# EAGLE design RFID_H2_v6 (EAGLE 9.6.2)
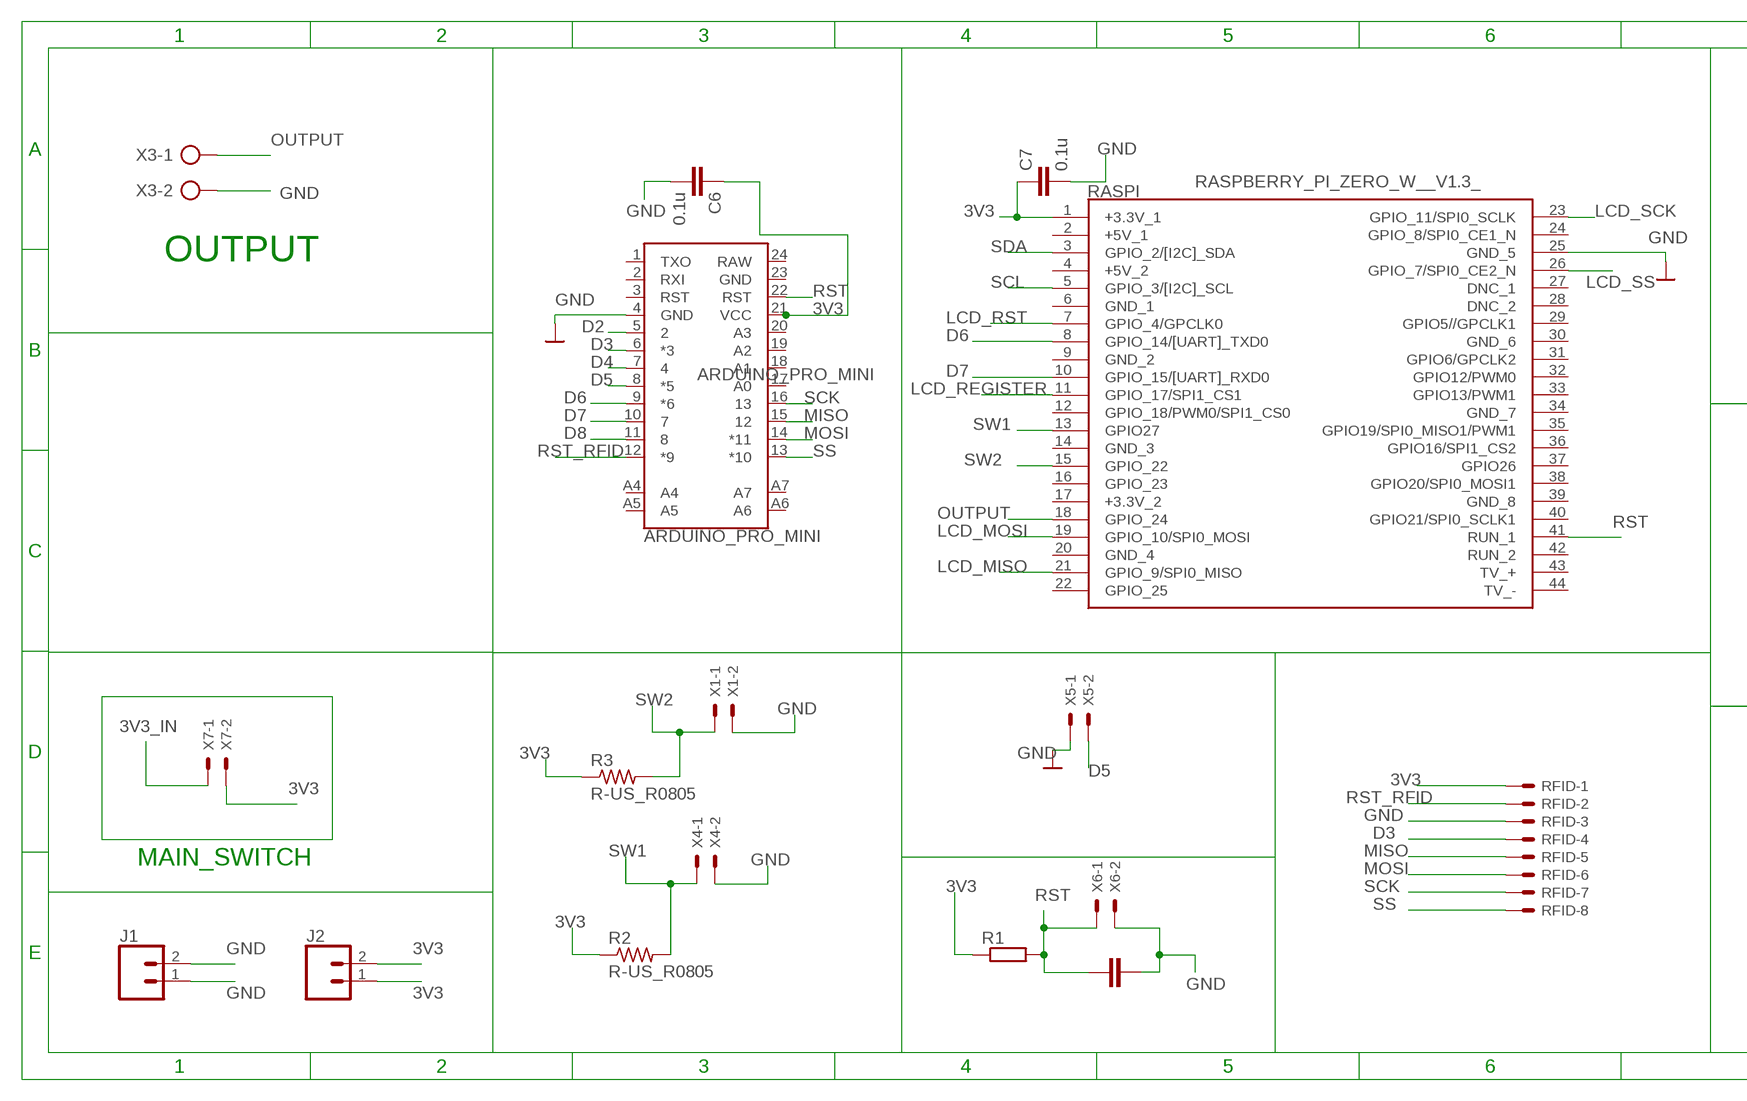
[diagram p0: schematic, sheet 1, part 1 of 2]
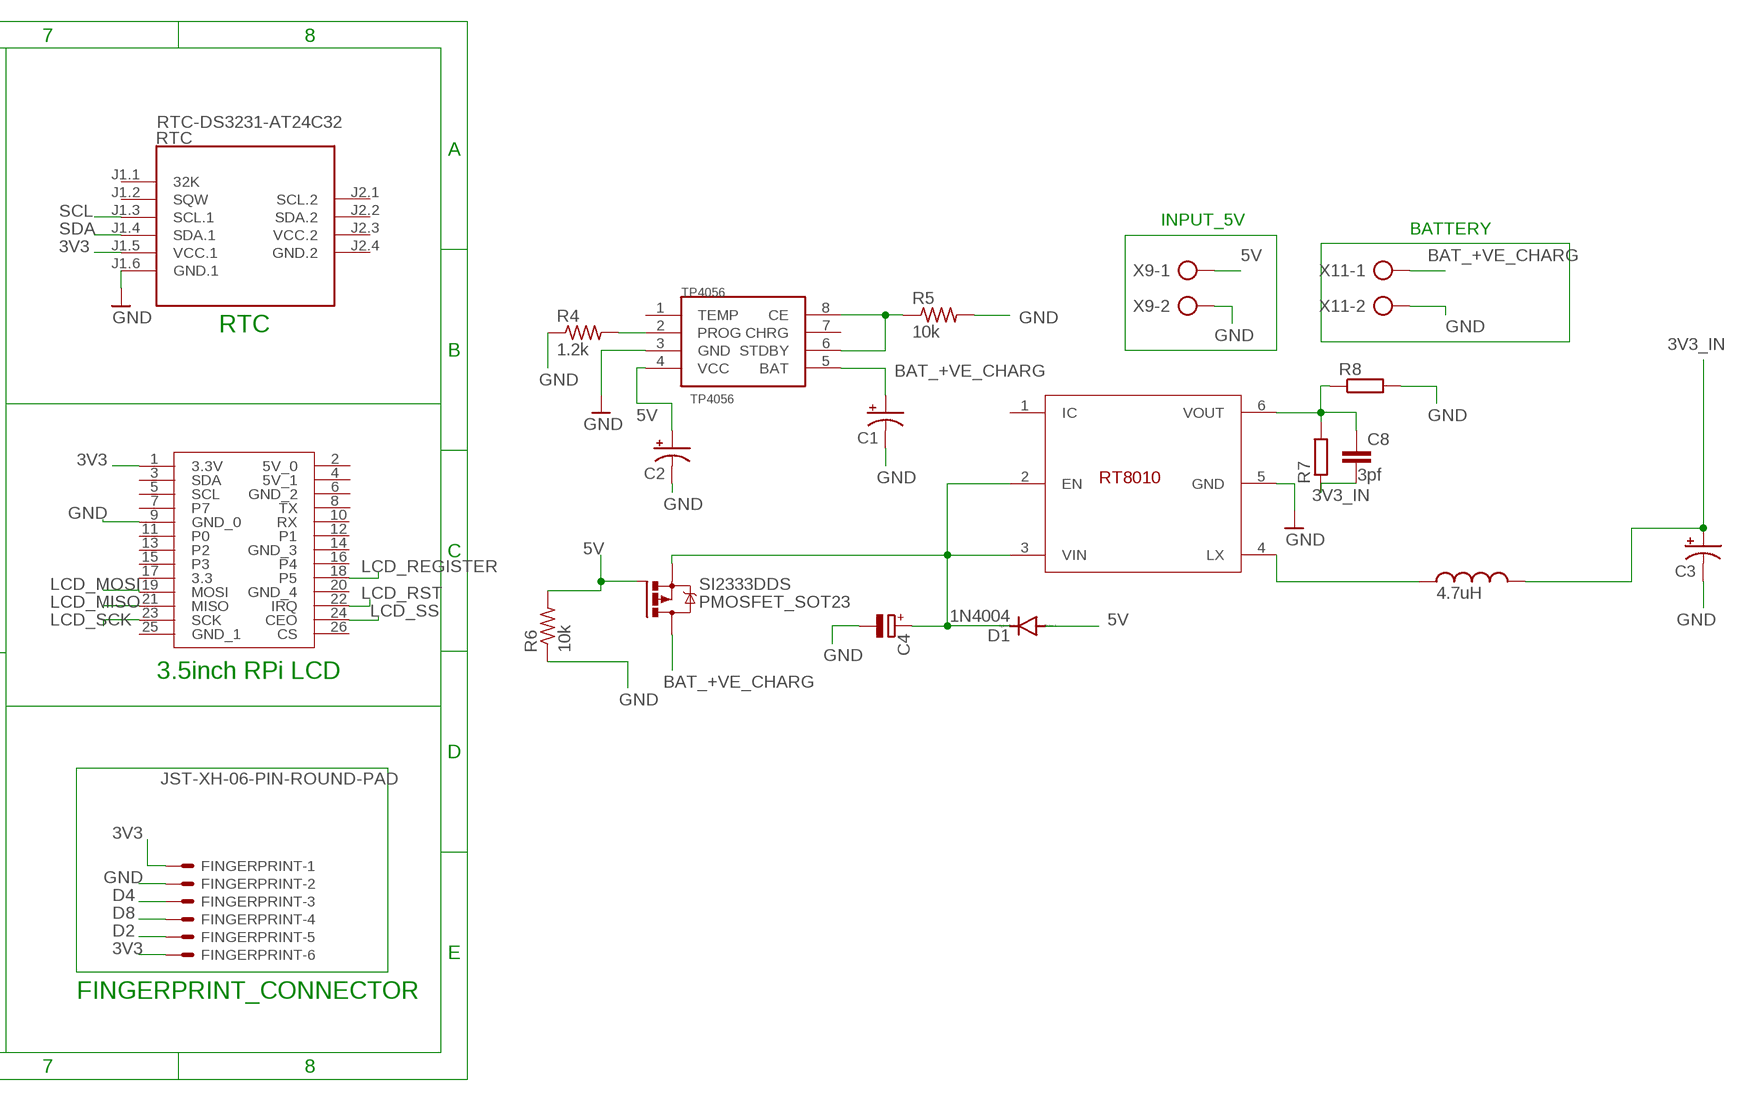
[diagram p1: schematic, sheet 1, part 2 of 2]

## Parts
ARDUINO_PRO_MINI  ARDUINO_PRO_MINI  [ARDUINO_PRO_MINI]
C1  10uf  CAP_POL_10V  [C/6032-28R]
C2  10uf  CAP_POL_10V  [C/6032-28R]
C3  10uf  CAP_POL_10V  [C/6032-28R]
C4  4.7uf  CPOL-EUE2.5-6  [E2,5-6]
C5  10n  C-EUC0805K  [C0805K]
C6  0.1u  C-EUC0805  [C0805]
C7  0.1u  C-EUC0805  [C0805]
C8  3pf  C-EU025-025X050  [C025-025X050]
D1  1N4004  [DO41-10]
FINGERPRINT  JST-XH-06-PIN-ROUND-PAD  [JST-XH-06-PACKAGE-ROUND-PAD]
J1  CONN_02  [1X02]
J2  CONN_02  [1X02]
L2  4.7uH  WE-TI_8095_744772047  [WE-TI_TIHV_8095]
R1  R-EU_0204/5  [0204/5]
R2  R-US_R0805  [R0805]
R3  R-US_R0805  [R0805]
R4  1.2k  R-US_R0805  [R0805]
R5  10k  R-US_R0805  [R0805]
R6  10k  R-US_R0805  [R0805]
R7  1.2M  R-EU_0204/7  [0204/7]
R8  270K  R-EU_0204/7  [0204/7]
RASPI  RASPBERRY_PI_ZERO_W__V1.3_  [RASPBERRYPIZEROWV13]
RFID  JST-XH-08-PIN-ROUND-PAD  [JST-XH-08-PACKAGE-ROUND-PAD]
RT8010  RT8010_BUCK_CONVERTER  [RT8010]
RTC  RTC-DS3231-AT24C32  [RTC-DS3231-AT24C32]
SI2333DDS  PMOSFET_SOT23  [SOT23]
TP4056  TP4056  [SOP-8]
U$7  3.5_INCH_TOUCHSCREEN  [FE13-2]
X1  JST-XH-02-PIN-LONG-PAD  [JST-XH-02-PACKAGE-LONG-PAD]
X3  AK500/2-H  [AK500/2-H]
X4  JST-XH-02-PIN-LONG-PAD  [JST-XH-02-PACKAGE-LONG-PAD]
X5  JST-XH-02-PIN-LONG-PAD  [JST-XH-02-PACKAGE-LONG-PAD]
X6  JST-XH-02-PIN-LONG-PAD  [JST-XH-02-PACKAGE-LONG-PAD]
X7  JST-XH-02-PIN-LONG-PAD  [JST-XH-02-PACKAGE-LONG-PAD]
X9  AK500/2-H  [AK500/2-H]
X11  AK500/2-H  [AK500/2-H]

## Nets
3V3: ARDUINO_PRO_MINI.21(VCC) C6.1 C7.1 FINGERPRINT.1 FINGERPRINT.6 J2.1 J2.2 R1.1 R2.1 R3.1 RASPI.1(+3.3V_1) RFID.1 RTC.J1.5(VCC.1) U$7.1(3.3V) X7.2
3V3_IN: C3.+ C8.2 L2.2 R7.1 X7.1
5V: C2.+ D1.A R6.2 SI2333DDS.1(G) TP4056.4(VCC) X9.1
BAT_+VE_CHARG: C1.+ SI2333DDS.3(D) TP4056.5(BAT) X11.1
D2: ARDUINO_PRO_MINI.5 FINGERPRINT.5
D3: ARDUINO_PRO_MINI.6(*3) RFID.4
D4: ARDUINO_PRO_MINI.7 FINGERPRINT.3
D5: ARDUINO_PRO_MINI.8(*5) X5.2
D6: ARDUINO_PRO_MINI.9(*6) RASPI.8(GPIO_14/[UART]_TXD0)
D7: ARDUINO_PRO_MINI.10 RASPI.10(GPIO_15/[UART]_RXD0)
D8: ARDUINO_PRO_MINI.11 FINGERPRINT.4
GND: ARDUINO_PRO_MINI.4(GND) C1.- C2.- C3.- C4.- C5.1 C6.2 C7.2 FINGERPRINT.2 J1.1 J1.2 R4.1 R5.2 R6.1 R8.2 RASPI.25(GND_5) RFID.3 RT8010.5(GND) RTC.J1.6(GND.1) TP4056.3(GND) U$7.9(GND_0) X1.2 X3.2 X4.2 X5.1 X6.2 X9.2 X11.2
LCD_MISO: RASPI.21(GPIO_9/SPI0_MISO) U$7.21(MISO)
LCD_MOSI: RASPI.19(GPIO_10/SPI0_MOSI) U$7.19(MOSI)
LCD_REGISTER: RASPI.11(GPIO_17/SPI1_CS1) U$7.18(P5)
LCD_RST: RASPI.7(GPIO_4/GPCLK0) U$7.22(IRQ)
LCD_SCK: RASPI.23(GPIO_11/SPI0_SCLK) U$7.23(SCK)
LCD_SS: RASPI.26(GPIO_7/SPI0_CE2_N) U$7.24(CEO)
MISO: ARDUINO_PRO_MINI.15 RFID.5
MOSI: ARDUINO_PRO_MINI.14(*11) RFID.6
N$2: C8.1 R7.2 R8.1 RT8010.6(VOUT)
N$4: R4.2 TP4056.2(PROG)
N$5: R5.1 TP4056.6(STDBY) TP4056.8(CE)
N$6: L2.1 RT8010.4(LX)
N$8: C4.+ D1.C RT8010.2(EN) RT8010.3(VIN) SI2333DDS.2(S)
OUTPUT: RASPI.18(GPIO_24) X3.1
RST: ARDUINO_PRO_MINI.22(RST) C5.2 R1.2 RASPI.41(RUN_1) X6.1
RST_RFID: ARDUINO_PRO_MINI.12(*9) RFID.2
SCK: ARDUINO_PRO_MINI.16 RFID.7
SCL: RASPI.5(GPIO_3/[I2C]_SCL) RTC.J1.3(SCL.1)
SDA: RASPI.3(GPIO_2/[I2C]_SDA) RTC.J1.4(SDA.1)
SS: ARDUINO_PRO_MINI.13(*10) RFID.8
SW1: R2.2 RASPI.13(GPIO27) X4.1
SW2: R3.2 RASPI.15(GPIO_22) X1.1
Unconnected: ARDUINO_PRO_MINI.1(TXO) ARDUINO_PRO_MINI.2(RXI) ARDUINO_PRO_MINI.3(RST) ARDUINO_PRO_MINI.17(A0) ARDUINO_PRO_MINI.18(A1) ARDUINO_PRO_MINI.19(A2) ARDUINO_PRO_MINI.20(A3) ARDUINO_PRO_MINI.A4 ARDUINO_PRO_MINI.A5 ARDUINO_PRO_MINI.A6 ARDUINO_PRO_MINI.A7 RASPI.2(+5V_1) RASPI.4(+5V_2) RASPI.6(GND_1) RASPI.9(GND_2) RASPI.12(GPIO_18/PWM0/SPI1_CS0) RASPI.14(GND_3) RASPI.16(GPIO_23) RASPI.17(+3.3V_2) RASPI.20(GND_4) RASPI.22(GPIO_25) RASPI.24(GPIO_8/SPI0_CE1_N) RASPI.27(DNC_1) RASPI.28(DNC_2) RASPI.29(GPIO5//GPCLK1) RASPI.30(GND_6) RASPI.31(GPIO6/GPCLK2) RASPI.32(GPIO12/PWM0) RASPI.33(GPIO13/PWM1) RASPI.34(GND_7) RASPI.35(GPIO19/SPI0_MISO1/PWM1) RASPI.36(GPIO16/SPI1_CS2) RASPI.37(GPIO26) RASPI.38(GPIO20/SPI0_MOSI1) RASPI.39(GND_8) RASPI.40(GPIO21/SPI0_SCLK1) RASPI.42(RUN_2) RASPI.43(TV_+) RASPI.44(TV_-) RT8010.1(IC) RTC.J1.1(32K) RTC.J1.2(SQW) RTC.J2.1(SCL.2) RTC.J2.2(SDA.2) TP4056.1(TEMP) TP4056.7(CHRG) U$7.2(5V_0) U$7.3(SDA) U$7.4(5V_1) U$7.5(SCL) U$7.6(GND_2) U$7.7 U$7.8(TX) U$7.10(RX) U$7.11(P0) U$7.12(P1) U$7.13(P2) U$7.14(GND_3) U$7.15(P3) U$7.16(P4) U$7.17(3.3) U$7.20(GND_4) U$7.25(GND_1) U$7.26(CS)

## Notes on the sheet
- INPUT_5V
- BATTERY
- OUTPUT
- RTC
- 3.5inch RPi LCD
- MAIN_SWITCH
- FINGERPRINT_CONNECTOR

## Power pins joined to a net without a drawn wire
GND: ARDUINO_PRO_MINI.23(GND)
GND.2: RTC.J2.4(GND.2)
RAW: ARDUINO_PRO_MINI.24(RAW)
VCC.2: RTC.J2.3(VCC.2)

## Library data of the parts
ARDUINO_PRO_MINI = SparkFun-Boards:ARDUINO_PRO_MINI: SparkFun Pro Mini Pro Mini compatible footprint. Dimensions: 0.7 x 1.3" PCB Thickness: 0.8mm SparkFun Products: 3.3V/8MHz <https://www.sparkfun.com/products/11114> 5V/16MHz <https://www.sparkfun.com/products/11113>
C1-C3 = CEDT_JANUARY_2015_v5:CAP_POL
C4 = rcl:CPOL-EU: POLARIZED CAPACITOR, European symbol; SPICEPREFIX: C
C5-C8 = rcl:C-EU: CAPACITOR, European symbol; SPICEPREFIX: C
D1 = diode:1N4004: DIODE general purpose rectifier, 1 A
FINGERPRINT = Rembrandt Electronics - JST XH Connectors v1-0:JST-XH-06-PIN: JST XH Connector 2 Pin Wire to board connector. Pitch: 2,54 mm, (0.100") Number of pins: 6 Created by Rembrandt Electronics www.rembrandtelectronics.com
J1 J2 = SparkFun-Connectors:CONN_02: Multi connection point. Often used as Generic Header-pin footprint for 0.1 inch spaced/style header connections On any of the 0.1 inch spaced packages, you can populate with these: Break Away Headers - Straight <https://www.sparkfun.com/products/116> (PRT-00116) Break Away Male Headers - Right Angle <https://www.sparkfun.com/products/553> (PRT-00553) Female Headers <https://www.sparkfun.com/products/115> (PRT-00115) Break Away Headers - Machine Pin <https://www.sparkfun.com/products/117> (PRT-00117) Break Away Female Headers - Swiss Machine Pin <https://www.sparkfun.com/products/743> (PRT-00743) For SCREWTERMINALS and SPRING TERMINALS visit here: Screw Terimnals on SparkFun.com <https://www.sparkfun.com/search/results?term=Screw+Terminals> (5mm/3.5mm/2.54mm spacing) This device is also useful as a general connection point to wire up your design to another part of your project. Our various solder wires solder well into these plated through hole pads. Hook-Up Wire - Assortment (Stranded, 22 AWG) <https://www.sparkfun.com/products/11375> (PRT-11375) Hook-Up Wire - Assortment (Solid Core, 22 AWG) <https://www.sparkfun.com/products/11367> (PRT-11367) View the entire wire category on our website here <https://www.sparkfun.com/categories/141> Special notes: Molex polarized connector foot print use with: PRT-08233 with associated crimp pins and housings. 2.54_SCREWTERM for use with PRT-10571. 3.5mm Screw Terminal footprints for PRT-08084 5mm Screw Terminal footprints for use with PRT-08432
L2 = Wurth_Elektronik_Passive_rev19e:WE-TI_8095: Radial Leaded Wire Wound Inductor Characteristics Radial through-hole inductor High saturation core material Small size Maximum current up to 8.5 A Custom design on request Applications Signal filtering Switches, switching power supply for small and medium voltage Power supply filter EMI filter <http://katalog.we-online.de/media/images/v2/we-ti_tonneninduktivitaet.jpg> Details see: http://katalog.we-online.de/en/pbs/WE-TI? Updated by Dan Xu 2014-07-11 2014 (C) Wurth Elektronik; WE-NUMBER: 744772047/4,7uH
R1 = resistor:R-EU_: RESISTOR, European symbol
R2 R3 = audio amplifier example:R-US_: RESISTOR, American symbol
R4-R6 = adafruit:R-US_: RESISTOR, American symbol
R7 R8 = rcl:R-EU_: RESISTOR, European symbol; SPICEPREFIX: R
RASPI = Raspberry_Pi_Zero_W__v1.3_:RASPBERRY_PI_ZERO_W__V1.3_: Raspberry Pi Zero W (v1.3) Single-board Computers Source: Datasheet <https://cdn.sparkfun.com/assets/learn_tutorials/6/7/6/PiZero_1.pdf>; DESCRIPTION: Raspberry Pi Zero W (v1.3) Single-board Computers; HEIGHT: mm; MANUFACTURER_NAME: RASPBERRY-PI; MANUFACTURER_PART_NUMBER: Raspberry Pi Zero W (v1.3)
RFID = Rembrandt Electronics - JST XH Connectors v1-0:JST-XH-08-PIN: JST XH Connector 2 Pin Wire to board connector. Pitch: 2,54 mm, (0.100") Number of pins: 8 Created by Rembrandt Electronics www.rembrandtelectronics.com
RT8010 = RT8010_buckConverter:RT8010_BUCK_CONVERTER
RTC = diy-modules:RTC-DS3231-AT24C32: RTC Module with Battery and EEPROM based on DS3231 and AT24C32 chips Tutorial can be found here: https://edwardmallon.wordpress.com/2014/05/21/using-a-cheap-3-ds3231-rtc-at24c32-eeprom-from-ebay/ Click here to find device on ebay.com <http://www.ebay.com/sch/DS3231+AT24C32+module>
SI2333DDS = Transistor:PMOSFET: P-Channel MOSFET - Generic; CATEGORY: Transistor; SUB-CATEGORY: MOSFET; TYPE: P-Channel
TP4056 = TP4056:TP4056
U$7 = 3.5_inch_touchscreen:3.5_INCH_TOUCHSCREEN
X1 X4-X7 = Rembrandt Electronics - JST XH Connectors v1-0:JST-XH-02-PIN: JST XH Connector 2 Pin Wire to board connector. Pitch: 2,54 mm, (0.100") Number of pins: 2 Created by Rembrandt Electronics www.rembrandtelectronics.com
X3 X9 X11 = con-ptr500:AK500/2-H: CONNECTOR Aug. 2004 / PTR Meßtechnik: Die Bezeichnung der Serie AK505 wurde geändert. Es handelt sich hierbei um AK500 in horizontaler Ausführung.; OC_FARNELL: unknown; OC_NEWARK: unknown

## Board
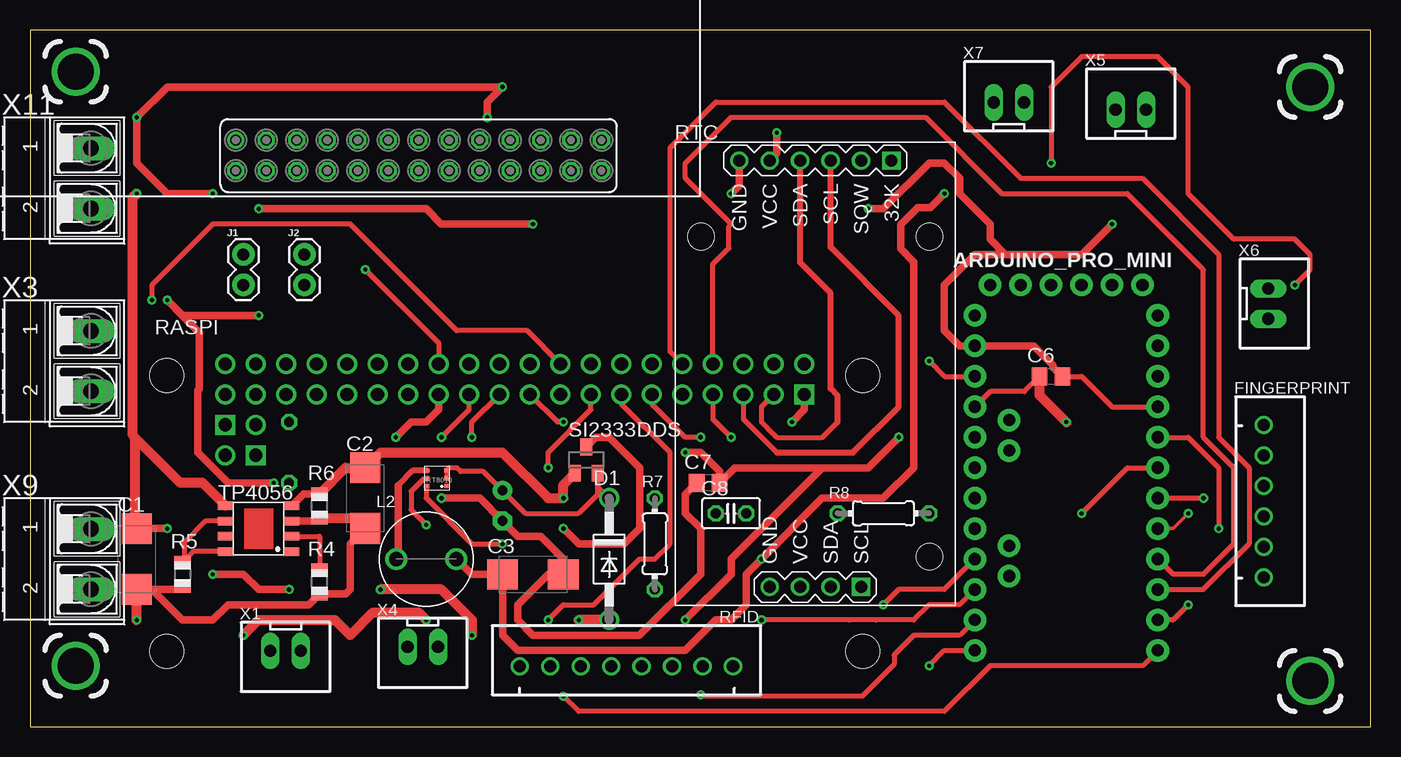
[diagram p2: board, top side]
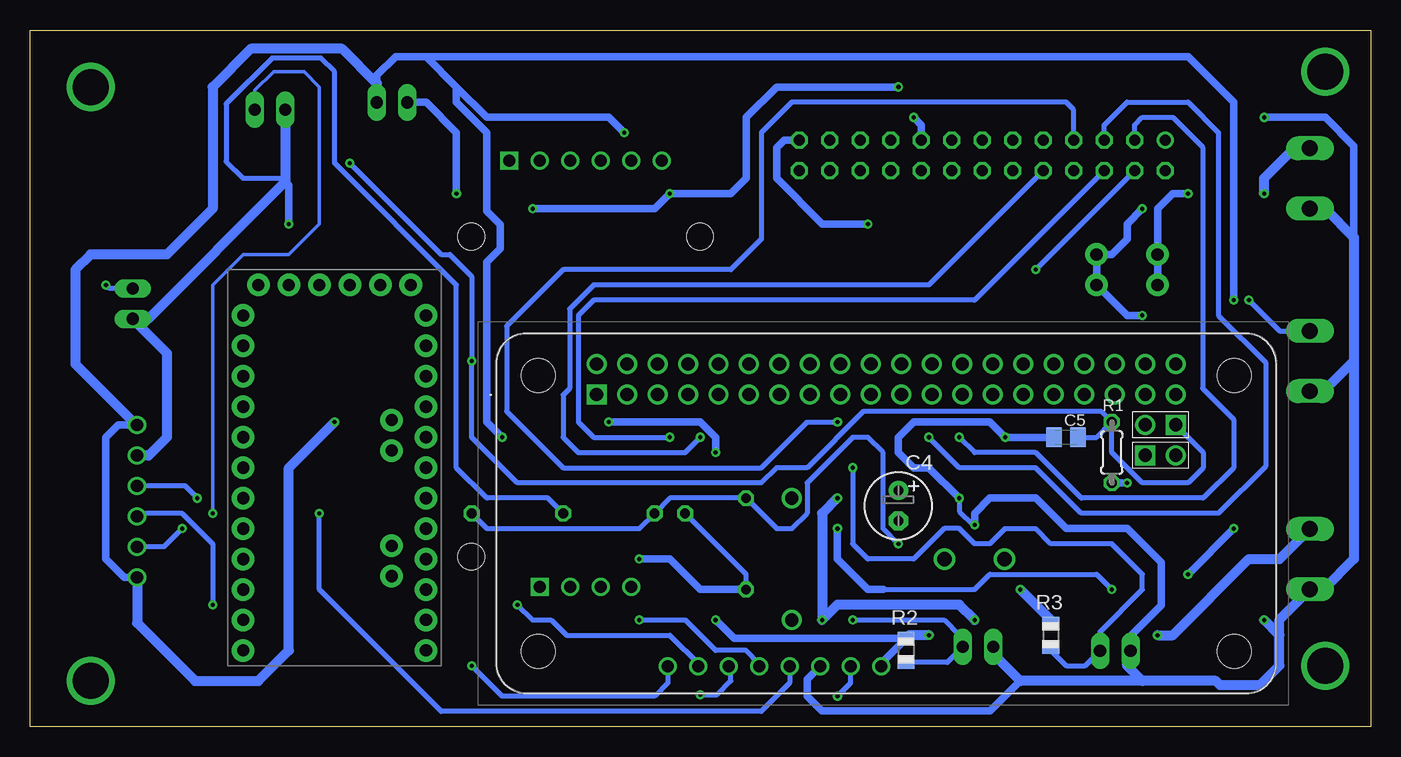
[diagram p3: board, bottom side, seen from below]

Size 111.74 x 58.09 mm. Coordinates in mm from the lower left corner, seen from the top.
Outline: 0,0 111.74,0 111.74,58.09 0,58.09 0,0
Copper layers (1*16): Top 0.035mm / dielectric 1.5mm / Bottom 0.035mm
Design rules "default": minimum track width 6mil, minimum drill 0.35mm, track to track 6mil, track to pad 6mil, pad to pad 6mil, via to via 6mil, smd to smd 6mil, copper to edge 40mil, drill to drill 6mil, minimum pad ring 10mil, minimum via ring 8mil, stop-mask expansion 4mil, vias tented up to drill 0mil, thermal gap 10mil

### Footprints (pad centres in the part's own frame; a part is rotated, then mirrored left to right if it is on the bottom)
ARDUINO_PRO_MINI = drill 1.016 pad 1.88: 1 -7.62,12.7; 2 -7.62,10.16; 3 -7.62,7.62; 4 -7.62,5.08; 5 -7.62,2.54; 6 -7.62,0; 7 -7.62,-2.54; 8 -7.62,-5.08; 9 -7.62,-7.62; 10 -7.62,-10.16; 11 -7.62,-12.7; 12 -7.62,-15.24; 13 7.62,-15.24; 14 7.62,-12.7; 15 7.62,-10.16; 16 7.62,-7.62; 17 7.62,-5.08; 18 7.62,-2.54; 19 7.62,0; 20 7.62,2.54; 21 7.62,5.08; 22 7.62,7.62; 23 7.62,10.16; 24 7.62,12.7; A4 4.763,1.429; A5 4.763,3.969; A6 4.763,-9.049; A7 4.763,-6.509; BLK -6.35,15.24; GND -3.81,15.24; GRN 6.35,15.24; RXI 1.27,15.24; TXO 3.81,15.24; VCC -1.27,15.24
C/6032-28R = smd 2.55 x 2.5: + 2.525,0; - -2.525,0
E2,5-6 = drill 0.813 pad 1.6: + -1.27,0 | drill 0.813 pad 1.6 octagon: - 1.27,0
C0805K = smd 1.3 x 1.6: 1 -1,0; 2 1,0
C0805 = smd 1.3 x 1.5: 1 -0.95,0; 2 0.95,0
C025-025X050 = drill 0.813 octagon: 1 -1.27,0; 2 1.27,0
DO41-10 = drill 1.118: A 5.08,0; C -5.08,0
JST-XH-06-PACKAGE-ROUND-PAD = drill 1.016: 1 -6.35,0; 2 -3.81,0; 3 -1.27,0; 4 1.27,0; 5 3.81,0; 6 6.35,0
1X02 = drill 1.016 pad 1.88: 1 0,0; 2 2.54,0
WE-TI_TIHV_8095 = drill 1.2: 1 -2.5,0; 2 2.5,0
0204/5 = drill 0.813 octagon: 1 -2.54,0; 2 2.54,0
R0805 = smd 1.1 x 1.4: 1 -1,0; 2 1,0
0204/7 = drill 0.813 octagon: 1 -3.81,0; 2 3.81,0
RASPBERRYPIZEROWV13 = drill 1.11 pad 1.665 square: 1 -23.885,9.92; 41 24.375,7.38; 43 21.835,4.84 | drill 1.11 pad 1.665: 2 -23.885,12.46; 3 -21.345,9.92; 4 -21.345,12.46; 5 -18.805,9.92; 6 -18.805,12.46; 7 -16.265,9.92; 8 -16.265,12.46; 9 -13.725,9.92; 10 -13.725,12.46; 11 -11.185,9.92; 12 -11.185,12.46; 13 -8.645,9.92; 14 -8.645,12.46; 15 -6.105,9.92; 16 -6.105,12.46; 17 -3.565,9.92; 18 -3.565,12.46; 19 -1.025,9.92; 20 -1.025,12.46; 21 1.515,9.92; 22 1.515,12.46; 23 4.055,9.92; 24 4.055,12.46; 25 6.595,9.92; 26 6.595,12.46; 27 9.135,9.92; 28 9.135,12.46; 29 11.675,9.92; 30 11.675,12.46; 31 14.215,9.92; 32 14.215,12.46; 33 16.755,9.92; 34 16.755,12.46; 35 19.295,9.92; 36 19.295,12.46; 37 21.835,9.92; 38 21.835,12.46; 39 24.375,9.92; 40 24.375,12.46; 42 21.835,7.38; 44 24.375,4.84 | hole 2.8: -28.755,11.5; -28.755,-11.5; 29.245,-11.5; 29.245,11.5
JST-XH-08-PACKAGE-ROUND-PAD = drill 1.016: 1 -8.89,0; 2 -6.35,0; 3 -3.81,0; 4 -1.27,0; 5 1.27,0; 6 3.81,0; 7 6.35,0; 8 8.89,0
RT8010 = smd 0.35 x 0.4: 1 0.375,0.2; 2 1.025,0.2; 3 1.675,0.2; 4 1.675,1.85; 5 1.025,1.85; 6 0.375,1.85
RTC-DS3231-AT24C32 = drill 1 square: J1.1 -17.78,6.35; J2.1 17.78,3.81 | drill 1: J1.2 -17.78,3.81; J1.3 -17.78,1.27; J1.4 -17.78,-1.27; J1.5 -17.78,-3.81; J1.6 -17.78,-6.35; J2.2 17.78,1.27; J2.3 17.78,-1.27; J2.4 17.78,-3.81 | hole 2.2: -11.43,-9.525; -11.43,9.525; 15.24,9.525
SOT23 = smd 1 x 1.4: 1 -0.95,-1.1; 2 0.95,-1.1; 3 0,1.1
SOP-8 = smd 1.3 x 0.7: 1 -2.75,1.905; 2 -2.75,0.635; 3 -2.75,-0.635; 4 -2.75,-1.905; 5 2.75,-1.905; 6 2.75,-0.635; 7 2.75,0.635; 8 2.75,1.905
FE13-2 = drill 0.914 octagon: 1 15.24,1.27; 2 15.24,-1.27; 3 12.7,1.27; 4 12.7,-1.27; 5 10.16,1.27; 6 10.16,-1.27; 7 7.62,1.27; 8 7.62,-1.27; 9 5.08,1.27; 10 5.08,-1.27; 11 2.54,1.27; 12 2.54,-1.27; 13 0,1.27; 14 0,-1.27; 15 -2.54,1.27; 16 -2.54,-1.27; 17 -5.08,1.27; 18 -5.08,-1.27; 19 -7.62,1.27; 20 -7.62,-1.27; 21 -10.16,1.27; 22 -10.16,-1.27; 23 -12.7,1.27; 24 -12.7,-1.27; 26 -15.24,-1.27 | drill 0.914: 25 -15.24,1.27
JST-XH-02-PACKAGE-LONG-PAD = drill 1.016 long: 1 -1.27,0; 2 1.27,0
AK500/2-H = drill 1.321 long: 1 -2.515,0; 2 2.515,0

### Placement (x,y rotation side)
ARDUINO_PRO_MINI  86.36,21.59 0 bottom
C1  8.89,13.97 90 top
C2  27.94,19.05 90 top
C3  41.91,12.7 180 top
C4  39.37,18.41 270 bottom
C5  25.4,24.13 0 bottom
C6  85.09,29.21 0 top
C7  56.52,20.32 180 top
C8  58.42,17.78 180 top
D1  48.26,13.97 270 top
FINGERPRINT  102.82,18.8 270 top
J1  17.78,36.83 90 top
J2  22.86,36.83 90 top
L2  33.02,13.97 0 top
R1  21.59,22.86 90 bottom
R2  38.73,6.35 270 bottom
R3  26.67,7.62 270 bottom
R4  24.13,12.06 90 top
R5  12.7,12.7 270 top
R6  24.13,18.41 90 top
R7  52.07,15.24 90 top
R8  71.12,17.78 180 top
RASPI  40.64,17.78 0 bottom
RFID  49.7,5.03 0 top
RT8010  34.92,19.68 90 top
RTC  65.44,29.43 270 top
SI2333DDS  46.35,22.22 0 top
TP4056  19.05,16.51 180 top
U$7  32.38,47.62 0 top
X1  21.3,6.32 180 top
X3  5.08,30.48 270 top
X4  32.73,6.65 180 top
X5  91.73,51.44 0 top
X6  103.18,35.27 270 top
X7  81.57,52.05 0 top
X9  5.08,13.97 270 top
X11  5.08,45.72 270 top

### Tracks (layer width: path | path; a pad name or v marks a point on that pad's centre or on a via)
3V3  (via drill 0.35)
  Top 0.406: 83.82,29.21 C6.1 82.87,27.94 80.01,27.94 ARDUINO_PRO_MINI.21
  Top 0.61: v19.05,34.29 12.7,34.29 v11.43,35.56 14.12,32.87 14.12,28.15 13.97,28.01 13.97,22.86 16.51,20.32 v20.32,20.32 | v54.61,22.86 55.88,22.86 57.47,21.27 C7.1 58.73,21.59 66.04,21.59 | v62.23,49.53 62.23,47.81 RTC.J1.5 | v41.91,41.91 34.29,41.91 33.02,43.18 v19.05,43.18 | v72.39,24.13 69.85,21.59 66.04,21.59 | v54.61,8.89 58.42,12.7 58.42,13.97 66.04,21.59 | v63.5,25.4 64.53,26.43 RASPI.1
  Top 0.813: v86.36,25.4 84.14,27.62 C6.1 | v36.83,7.62 36.83,8.89 34.29,11.43 v29.21,11.43
  Bottom 0.406: FINGERPRINT.1 102.87,25.15
  Bottom 0.61: X7.2 82.84,54.32 81.28,55.88 78.74,55.88 | 78.74,55.88 15.24,55.88 11.43,52.07 v11.43,35.56 | v19.05,34.29 20.32,34.29 J2.1 J2.2 21.59,39.37 20.32,40.64 20.32,41.91 v19.05,43.18 | v20.32,20.32 R1.1 | v63.5,25.4 55.88,25.4 54.61,24.13 v54.61,22.86 | 78.74,55.88 76.2,53.34 | 76.2,53.34 73.66,50.8 63.5,50.8 v62.23,49.53 | 76.2,53.34 76.2,52.07 73.66,49.53 73.66,42.98 72.54,41.86 72.54,39.86 73.66,38.74 73.66,25.4 v72.39,24.13 | RFID.1 40.81,5.28 38.92,7.17 R2.1 53.07,7.35 v54.61,8.89 | U$7.1 48.9,48.9 49.53,48.26 49.53,45.72 45.72,41.91 v41.91,41.91 | FINGERPRINT.1 104.39,25.15 105.41,24.13 105.41,13.97 103.89,12.45 FINGERPRINT.6
  Bottom 0.813: X7.2 82.84,53.63 85.72,56.52 93.34,56.52 96.52,53.34 96.52,43.18 100.33,39.37 106.68,39.37 107.95,38.1 107.95,30.23 102.87,25.15 | FINGERPRINT.6 102.82,8.64 97.99,3.81 92.71,3.81 90.17,6.35 90.17,21.59 v86.36,25.4 | v36.83,7.62 38.47,7.62 38.92,7.17 | R3.1 26.67,8.89 v29.21,11.43
3V3_IN  (via drill 0.35)
  Top 0.61: v76.2,44.45 75.03,43.28 73.96,43.28 72.54,41.86 72.54,39.86 73.66,38.74 73.66,21.59 71.12,19.05 66.04,19.05 v60.96,13.97 59.69,12.7 59.69,10.16 58.42,8.89 57.15,8.89 54.61,6.35 40.64,6.35 39.38,7.61 C3.+ 36.83,12.7 35.56,13.97 L2.2
  Bottom 0.406: R7.1 52.07,12.7 C8.2
  Bottom 0.61: v76.2,44.45 76.2,49.53 78.74,52.07 80.28,52.07 X7.1 | R7.1 55.88,11.43 58.42,13.97 v60.96,13.97
5V  (via drill 0.35)
  Top 0.61: TP4056.4 22.8,19.41 R6.2
  Top 0.813: R6.2 26.29,21.57 C2.+ 29.23,22.86 39.37,22.86 43.18,19.05 v44.45,19.05 44.45,20.17 SI2333DDS.1 | D1.A v45.72,8.89 | v17.78,7.62 19.05,8.89 25.4,8.89 26.67,7.62 28.57,9.53 32.38,9.53 v33.02,8.89
  Bottom 0.813: 5.11,16.48 X9.1 7.59,13.97 10.16,13.97 16.51,7.62 v17.78,7.62 | v44.45,19.05 45.72,17.78 v45.72,8.89 44.45,10.16 34.29,10.16 v33.02,8.89
BAT_+VE_CHARG  (via drill 0.35)
  Top 0.61: SI2333DDS.3 47.16,24.13 48.26,24.13 50.8,21.59 50.8,16.51 49.53,15.24 45.72,15.24 v44.45,16.51 | v21.59,11.43 19.05,11.43 17.78,12.7 v15.24,12.7 | v11.43,16.51 8.88,16.51 8.72,16.66
  Top 0.813: 8.72,24.13 8.72,16.66 C1.+ | TP4056.5 14.39,20.32 12.54,20.32 8.72,24.13 | 8.72,24.13 8.57,24.28 8.57,44.13 v8.89,44.45
  Bottom 0.406: v21.59,11.43 22.86,12.7 31.75,12.7 33.02,11.43 40.64,11.43
  Bottom 0.61: v15.24,12.7 v11.43,16.51 | 40.64,11.43 41.91,11.43 44.45,13.97 v44.45,16.51
  Bottom 0.813: v8.89,44.45 8.89,45.72 6.38,48.24 X11.1
D2  (via drill 0.35)
  Top 0.406: ARDUINO_PRO_MINI.5 96.52,24.13 99.06,21.59 v99.06,16.51
  Bottom 0.406: v99.06,16.51 100.58,14.99 FINGERPRINT.5
D3  (via drill 0.35)
  Top 0.406: v87.63,17.78 91.44,21.59 ARDUINO_PRO_MINI.6
  Bottom 0.406: RFID.4 48.43,3.64 50.8,1.27 77.47,1.27 87.63,11.43 v87.63,17.78
D4  (via drill 0.35)
  Top 0.406: ARDUINO_PRO_MINI.7 v97.79,19.05
  Bottom 0.406: v97.79,19.05 98.81,20.07 FINGERPRINT.3
D5  (via drill 0.35)
  Top 0.305: v96.52,17.78 95.25,16.51 ARDUINO_PRO_MINI.8
  Bottom 0.305: X5.2 93,53.05 91.44,54.61 88.9,54.61 87.63,53.34 87.63,41.91 90.17,39.37 93.98,39.37 96.52,36.83 v96.52,17.78
D6
  Top 0.406: ARDUINO_PRO_MINI.9 95.25,12.7 97.79,12.7 100.33,15.24 100.33,21.59 97.79,24.13 97.79,38.1 91.44,44.45 80.97,44.45 74.62,50.8 58.42,50.8 54.61,46.99 54.61,45.72 58.42,41.91 58.23,41.72 58.23,39.9 56.91,38.57 RASPI.8
D7
  Top 0.406: ARDUINO_PRO_MINI.10 97.79,11.43 101.6,15.24 101.6,21.59 99.06,24.13 99.06,39.37 92.71,45.72 82.55,45.72 76.2,52.07 57.15,52.07 53.34,48.26 53.34,31.27 RASPI.10
D8  (via drill 0.35)
  Top 0.406: v96.52,10.16 95.25,8.89 ARDUINO_PRO_MINI.11
  Bottom 0.406: FINGERPRINT.4 102.57,17.78 99.06,17.78 96.52,15.24 v96.52,10.16
GND  (via drill 0.35)
  Top 0.406: C6.2 87.63,29.21 90.17,26.67 ARDUINO_PRO_MINI.4 | RT8010.5 32.98,20.62 32.76,20.62 31.75,19.61 31.75,18.09 v33.02,16.82
  Top 0.61: C2.- 27.94,16.51 26.67,15.24 26.67,11.43 26.3,11.06 R4.1 23.23,10.16 16.51,10.16 15.24,8.89 12.7,8.89 12.7,8.9 10.16,11.45 | C3.- 43.18,12.7 40.64,10.16 40.64,8.89 41.91,7.62 47.7,7.62 47.72,7.6 50.77,7.6 55.88,12.7 55.88,16.51 54.61,17.78 54.61,19.36 C7.2 | 44.45,12.7 C3.- | C1.- 10.16,11.45 | 10.16,11.45 12.45,11.45 R5.2 | C6.2 85.25,30 85.25,30.15 83.65,31.75 ARDUINO_PRO_MINI.23 77.47,31.75 76.2,33.02 76.2,36.83 78.74,39.37 81.28,39.37 | TP4056.3 23.86,17.14 R6.1 | RTC.J1.6 59.09,45.12 v58.42,44.45 | v38.1,50.8 38.1,52.07 v39.37,53.34 11.43,53.34 v8.89,50.8 8.89,46.99 11.43,44.45 v15.24,44.45 | v90.17,41.91 87.63,39.37 81.28,39.37 | 81.28,39.37 80.01,40.64 80.01,41.91 77.47,44.45 77.47,45.72 76.2,46.99 74.93,46.99 71.12,43.18 v69.85,43.18 | v30.48,24.13 31.75,25.4 33.02,25.4 34.05,26.43 RASPI.25 | C3.- 44.44,13.98 42.55,15.88 40.64,15.88 C4.- 37.47,19.05 v34.29,19.05
  Top 0.813: R6.1 27.04,17.41 27.94,16.51 | v8.89,8.89 C1.-
  Bottom 0.406: X6.2 102.87,34 102.58,34 | v33.02,16.82 33.15,16.82 34.29,17.96 v34.29,19.05 | R8.2 68.58,19.05 73.66,19.05 76.2,21.59 76.2,36.83 86.36,46.99 86.36,54.61 87.5,55.75 91.57,55.75 95.39,51.93 95.39,47.13 93.98,45.72 90.46,45.72
  Bottom 0.508: 3.79,27.96 X3.2
  Bottom 0.61: 29.21,3.81 31.7,1.32 45.77,1.32 46.99,2.54 46.99,3.93 RFID.3 | U$7.9 37.47,50.17 v38.1,50.8 | v39.37,53.34 49.53,53.34 52.07,50.8 52.07,45.72 53.34,44.45 v58.42,44.45 59.69,43.18 v69.85,43.18 | v8.89,50.8 3.81,50.8 1.42,48.41 1.42,40.79 | 90.46,45.43 90.17,45.14 v90.17,41.91 | C5.1 v30.48,24.13 31.75,25.4 38.1,25.4 39.37,24.13 39.37,22.86 38.1,21.59 36.83,21.59 v34.29,19.05 | J1.1 J1.2 17.78,43.18 16.51,44.45 v15.24,44.45 | X1.2 20.03,7.59 17.49,10.13 17.49,13.68 20.32,16.51 25.4,16.51 27.94,19.05 31.75,19.05 33.02,17.78 v33.02,16.82
  Bottom 0.813: X11.2 5.05,43.18 3.81,43.18 1.42,40.79 1.42,30.48 | 1.42,30.48 3.94,27.96 X3.2 | 1.42,30.48 1.42,13.97 3.94,11.46 X9.2 7.62,8.91 7.62,7.62 | 7.62,7.62 7.62,5.08 9.24,3.46 12.56,3.46 12.92,3.81 19.05,3.81 | 19.05,3.81 20.32,5.08 20.32,6.03 X1.2 | X6.2 100.33,31.15 100.33,24.13 101.85,22.61 FINGERPRINT.2 | X5.1 90.46,45.72 90.46,45.43 101.89,34 102.87,34 | 19.05,3.81 29.21,3.81 31.46,6.06 X4.2 | 7.62,7.62 v8.89,8.89
LCD_MISO  (via drill 0.35)
  Top 0.406: v36.83,24.13 36.83,25.41 RASPI.21
  Bottom 0.406: U$7.21 22.23,50.17 20.32,52.07 15.24,52.07 12.7,49.53 12.7,34.29 8.78,30.36 8.78,21.7 12.7,17.78 24.13,17.78 27.94,21.59 34.29,21.59 v36.83,24.13
LCD_MOSI  (via drill 0.35)
  Top 0.406: v44.45,25.4 43.97,25.4 RASPI.19
  Bottom 0.406: U$7.19 24.77,51.44 25.4,52.07 48.26,52.07 50.8,49.53 50.8,40.64 53.34,38.1 67.31,38.1 72.01,33.4 72.01,26.29 67.31,21.59 50.8,21.59 46.99,25.4 v44.45,25.4
LCD_REGISTER  (via drill 0.35)
  Top 0.406: RASPI.11 51.83,26.91 54.61,24.13 v55.88,24.13
  Bottom 0.406: U$7.18 36.83,36.83 64.77,36.83 66.78,34.82 66.78,28.2 67.31,27.66 67.31,24.13 66.04,22.86 57.15,22.86 v55.88,24.13
LCD_RST  (via drill 0.35)
  Top 0.406: v58.42,24.13 56.91,25.64 RASPI.7
  Bottom 0.406: U$7.22 33.02,35.56 64.77,35.56 66.04,34.29 66.04,25.4 64.77,24.13 v58.42,24.13
LCD_SCK  (via drill 0.35)
  Top 0.406: RASPI.23 36.59,26.43 v34.29,24.13
  Bottom 0.406: U$7.23 19.68,50.17 19.05,50.8 16.51,50.8 14.01,48.3 14.01,28.2 11.43,25.61 11.43,21.59 13.97,19.05 24.13,19.05 27.94,22.86 33.02,22.86 v34.29,24.13
LCD_SS  (via drill 0.35)
  Top 0.406: v27.94,38.1 34.05,32 RASPI.26
  Bottom 0.406: U$7.24 v27.94,38.1
MISO  (via drill 0.35)
  Top 0.406: ARDUINO_PRO_MINI.15 77.47,10.16 74.93,10.16 73.66,8.89 70.49,8.89 70.48,8.9 68.31,8.9 68.3,8.89 v60.96,8.89
  Bottom 0.406: v60.96,8.89 57.15,8.89 54.61,6.35 52.07,6.35 50.97,5.25 RFID.5
MOSI  (via drill 0.35)
  Top 0.406: ARDUINO_PRO_MINI.14 77.47,7.62 73.66,7.62 72.01,5.97 72.01,5.2 69.36,2.54 55.88,2.54 v55.88,2.66
  Bottom 0.406: v55.88,2.66 54.49,2.66 53.34,3.81 53.34,4.86 RFID.6
N$2  (via drill 0.35)
  Top 0.406: RT8010.6 33.02,20 33.02,19.05 36.83,15.24 v39.37,15.24
  Bottom 0.406: R8.1 73.66,16.51 60.96,16.51 C8.1 58.42,19.05 R7.2 49.53,16.51 48.26,16.51 46.99,17.78 46.99,20.32 43.18,24.13 41.91,24.13 40.64,22.86 40.64,16.51 v39.37,15.24
N$4
  Top 0.406: R4.2 24.13,15.88 TP4056.2
N$5
  Top 0.406: TP4056.6 14.61,17.14 12.84,15.38 12.84,13.83 | TP4056.8 13.61,14.61 12.84,13.83 | 12.84,13.83 R5.1
N$6
  Top 0.508: RT8010.4 31.91,21.36 30.67,20.13
  Top 0.61: 30.67,20.13 30.67,14.12 L2.1
N$8
  Top 0.406: RT8010.2 RT8010.3 34.95,21.59 35.56,21.59 35.88,21.27 37.78,21.27 C4.+ 41.27,17.78 45.72,17.78 47.3,19.36 SI2333DDS.2 47.3,20 D1.C
N$10  (via drill 3)
  other vias: 106.68,3.81
N$12  (via drill 3)
  other vias: 106.68,53.34
N$13  (via drill 3)
  other vias: 3.81,5.08
N$14  (via drill 3)
  other vias: 3.81,54.61
OUTPUT  (via drill 0.35)
  Top 0.406: RASPI.18 41.42,33.02 35.56,33.02 26.67,41.91 15.24,41.91 10.16,36.83 v10.16,35.56
  Bottom 0.406: v10.16,35.56 7.59,33 X3.1
RST  (via drill 0.35)
  Top 0.406: ARDUINO_PRO_MINI.22 76.2,29.21 v74.93,30.48 | v105.41,36.83 106.68,38.1 106.68,39.37 105.41,40.64 100.33,40.64 96.52,44.45 96.52,53.34 93.98,55.88 87.63,55.88 85.09,53.34 v85.09,46.99
  Bottom 0.406: X6.1 105.12,36.54 v105.41,36.83 | v85.09,46.99 77.47,39.37 76.75,39.37 74.93,37.55 v74.93,30.48 74.93,24.13 71.12,20.32 50.8,20.32 49.53,21.59 46.99,21.59 42.32,26.26 22.45,26.26 R1.2 | RASPI.41 13.97,22.86 13.97,21.59 15.24,20.32 19.05,20.32 21.59,22.86 R1.2 | C5.2 22.86,24.13 R1.2
RST_RFID  (via drill 0.35)
  Top 0.406: ARDUINO_PRO_MINI.12 92.71,5.08 80.01,5.08 76.2,1.27 45.72,1.27 v44.45,2.54
  Bottom 0.406: v44.45,2.54 43.35,3.64 RFID.2
SCK  (via drill 0.35)
  Top 0.406: ARDUINO_PRO_MINI.16 76.2,11.43 72.39,11.43 v71.12,10.16
  Bottom 0.406: v71.12,10.16 69.86,8.9 68.31,8.9 67.03,7.62 58.42,7.62 55.94,5.14 RFID.7
SCL
  Top 0.406: RASPI.5 59.45,25.64 62.23,22.86
  Top 0.508: RTC.J1.3 66.71,39.97 72.39,34.29 72.39,26.67 68.58,22.86 62.23,22.86
SDA
  Top 0.406: 67.31,25.4 66.04,24.13 62.23,24.13 61.98,24.38 60.96,25.4 60.96,26.68 RASPI.3
  Top 0.508: 67.31,25.4 67.31,27.59 66.72,28.17 66.72,36.15 64.17,38.7 RTC.J1.4
SS  (via drill 0.35)
  Top 0.406: v74.93,5.08 76.2,6.35 ARDUINO_PRO_MINI.13
  Bottom 0.406: RFID.8 58.59,3.64 59.69,2.54 72.39,2.54 v74.93,5.08
SW1  (via drill 0.35)
  Top 0.406: v43.18,8.89 44.45,10.16 46.99,10.16 50.8,13.97 52.07,13.97 53.34,15.24 53.34,22.86 49.28,26.91 RASPI.13
  Bottom 0.406: X4.1 34.29,6.36 | 34.29,6.36 35.3,5.35 R2.2 | 34.29,6.36 34.29,7.62 35.56,8.89 v43.18,8.89
SW2  (via drill 0.35)
  Top 0.406: v43.18,21.59 43.18,22.86 46.74,26.43 RASPI.15
  Bottom 0.406: R3.2 26.67,6.35 25.4,5.08 23.81,5.08 X1.1 22.57,7.91 19.05,11.43 19.05,12.7 21.59,15.24 26.67,15.24 27.94,16.51 30.48,16.51 31.75,15.24 33.02,15.24 34.29,16.51 35.56,16.51 38.1,13.97 41.91,13.97 43.18,15.24 v43.18,21.59

### Text on the board
tNames: RT8010